# EAGLE design PIDRegler (EAGLE 7.5.0)
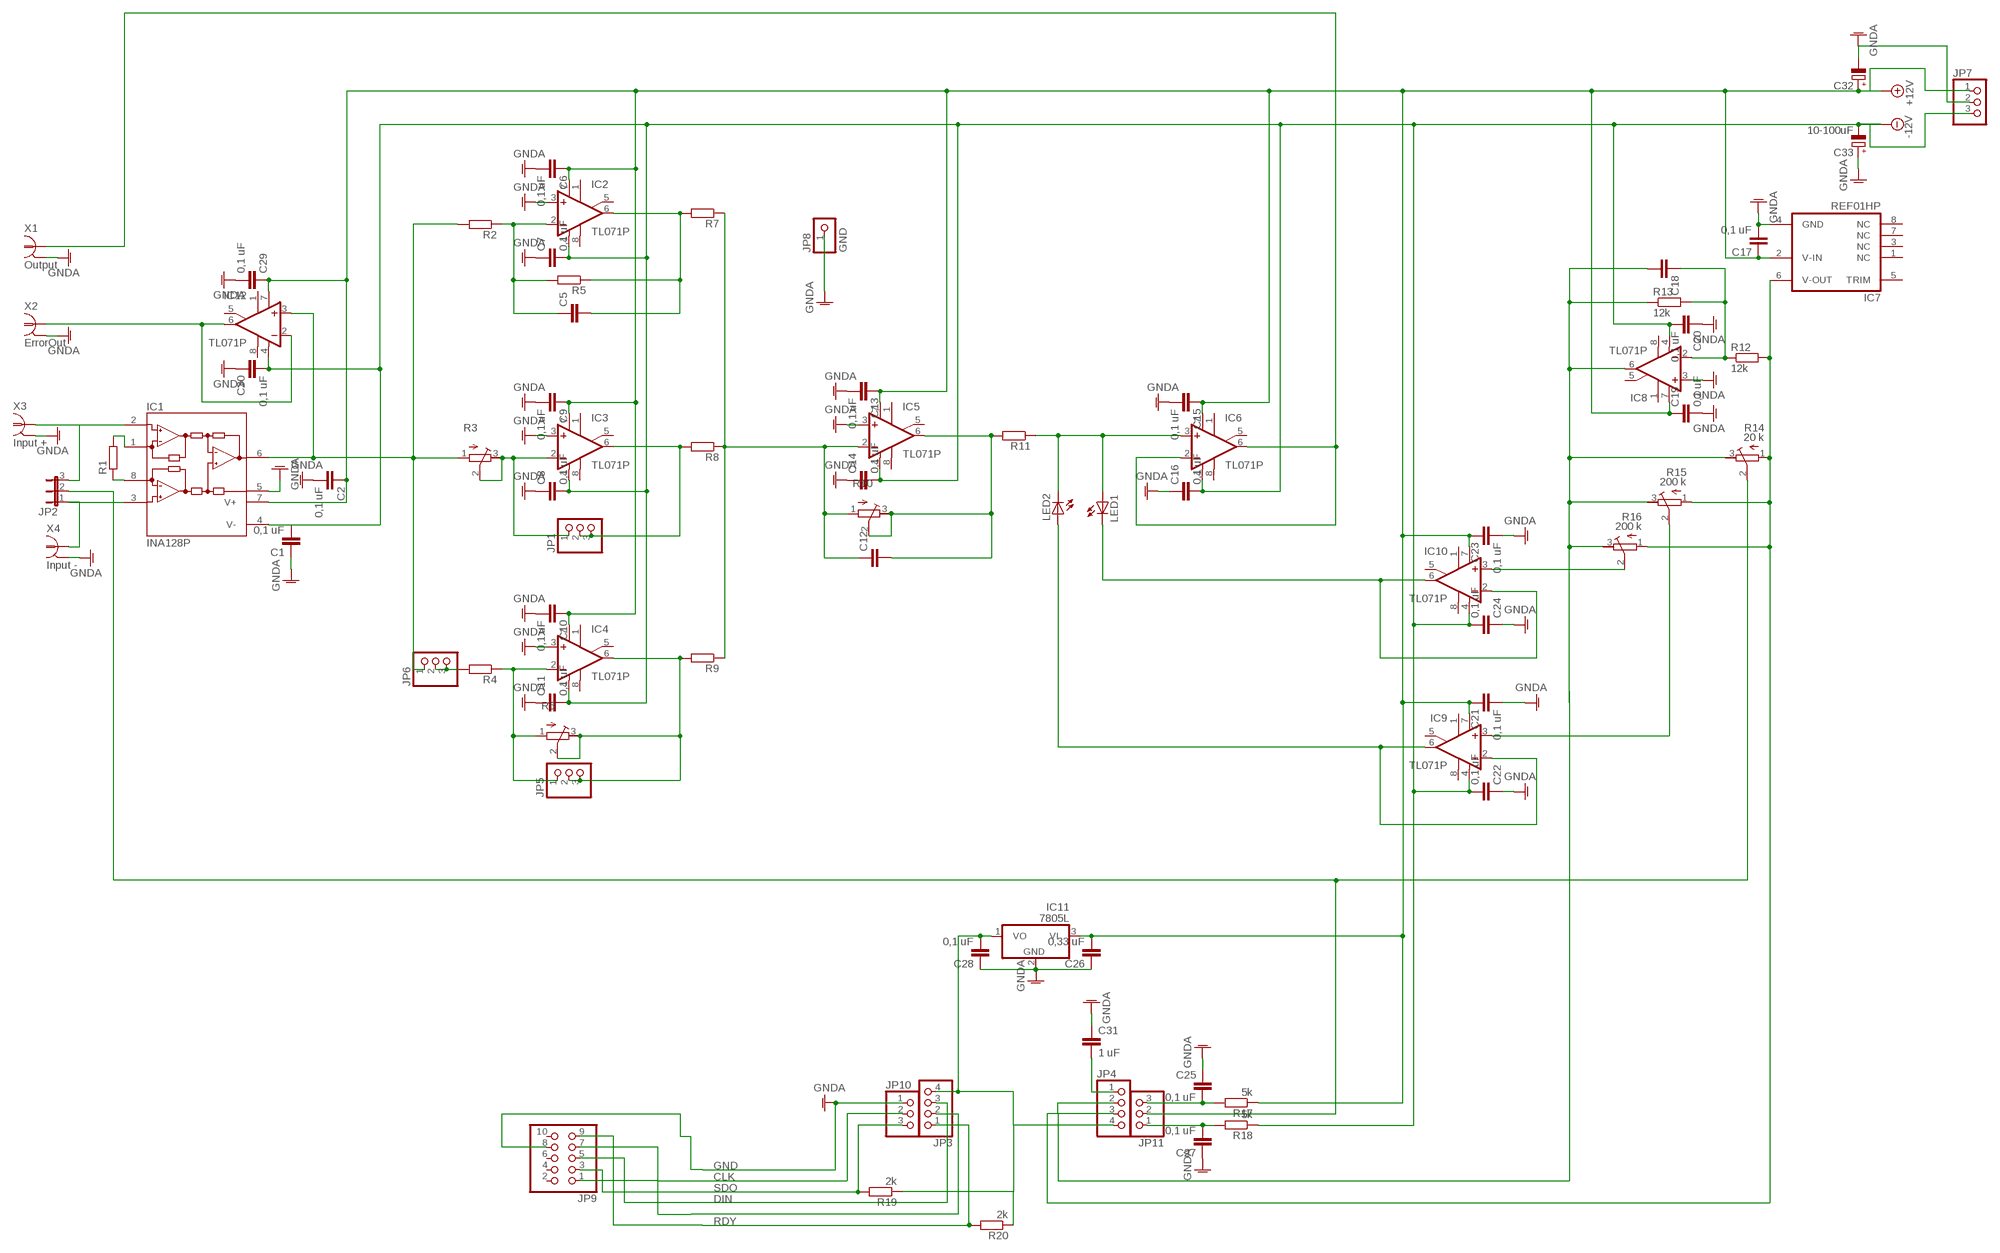
[diagram p0: schematic, sheet 1]

## Parts
C1  0,1 uF  C-EUC1206  [C1206]
C2  0,1 uF  C-EUC1206  [C1206]
C5  C-EUC1206  [C1206]
C6  0,1 uF  C-EUC1206  [C1206]
C7  0,1 uF  C-EUC1206  [C1206]
C8  0,1 uF  C-EUC1206  [C1206]
C9  0,1 uF  C-EUC1206  [C1206]
C10  0,1 uF  C-EUC1206  [C1206]
C11  0,1 uF  C-EUC1206  [C1206]
C12  C-EUC1206  [C1206]
C13  0,1 uF  C-EUC1206  [C1206]
C14  0,1 uF  C-EUC1206  [C1206]
C15  0,1 uF  C-EUC1206  [C1206]
C16  0,1 uF  C-EUC1206  [C1206]
C17  0,1 uF  C-EUC1206  [C1206]
C18  C-EUC1206  [C1206]
C19  0,1 uF  C-EUC1206  [C1206]
C20  0,1 uF  C-EUC1206  [C1206]
C21  0,1 uF  C-EUC1206  [C1206]
C22  0,1 uF  C-EUC1206  [C1206]
C23  0,1 uF  C-EUC1206  [C1206]
C24  0,1 uF  C-EUC1206  [C1206]
C25  0,1 uF  C-EUC1206  [C1206]
C26  0,33 uF  C-EUC1206  [C1206]
C27  0,1 uF  C-EUC1206  [C1206]
C28  0,1 uF  C-EUC1206  [C1206]
C29  0,1 uF  C-EUC1206  [C1206]
C30  0,1 uF  C-EUC1206  [C1206]
C31  1 uF  C-EUC1206  [C1206]
C32  CPOL-EUE2.5-6  [E2,5-6]
C33  10-100uF  CPOL-EUE2.5-6  [E2,5-6]
IC1  INA128P  [DIL08]
IC2  TL071P  [DIL08]
IC3  TL071P  [DIL08]
IC4  TL071P  [DIL08]
IC5  TL071P  [DIL08]
IC6  TL071P  [DIL08]
IC7  REF01HP  [DIL08]
IC8  TL071P  [DIL08]
IC9  TL071P  [DIL08]
IC10  TL071P  [DIL08]
IC11  7805L  [TO92]
IC12  TL071P  [DIL08]
JP1  PINHD-1X3  [1X03]
JP2  JP2E  [JP2]
JP3  PINHD-1X4  [1X04]
JP4  PINHD-1X4  [1X04]
JP5  PINHD-1X3  [1X03]
JP6  PINHD-1X3  [1X03]
JP7  PINHD-1X3  [1X03]
JP8  GND  PINHD-1X1  [1X01]
JP9  PINHD-2X5  [2X05]
JP10  PINHD-1X3  [1X03]
JP11  PINHD-1X3  [1X03]
LED1  LED5MM  [LED5MM]
LED2  LED5MM  [LED5MM]
R1  R-EU_M1206  [M1206]
R2  R-EU_M1206  [M1206]
R3  R-TRIMM64X  [RTRIM64X]
R4  R-EU_M1206  [M1206]
R5  R-EU_M1206  [M1206]
R6  R-TRIMM64X  [RTRIM64X]
R7  R-EU_M1206  [M1206]
R8  R-EU_M1206  [M1206]
R9  R-EU_M1206  [M1206]
R10  R-TRIMM64X  [RTRIM64X]
R11  R-EU_M1206  [M1206]
R12  12k  R-EU_M1206  [M1206]
R13  12k  R-EU_M1206  [M1206]
R14  20 k  R-TRIMM64X  [RTRIM64X]
R15  200 k  R-TRIMM64X  [RTRIM64X]
R16  200 k  R-TRIMM64X  [RTRIM64X]
R17  5k  R-EU_M1206  [M1206]
R18  5k  R-EU_M1206  [M1206]
R19  2k  R-EU_M1206  [M1206]
R20  2k  R-EU_M1206  [M1206]
X1  Output  1-227161-0  [AMP_227161]
X2  ErrorOut  1-227161-0  [AMP_227161]
X3  Input +  1-227161-0  [AMP_227161]
X4  Input -  1-227161-0  [AMP_227161]

## Nets
+12V: C2.1 C6.1 C9.1 C10.1 C13.1 C15.1 C17.1 C19.1 C21.1 C23.1 C26.2 C29.1 C32.+ IC1.7(V+) IC2.7(V+) IC3.7(V+) IC4.7(V+) IC5.7(V+) IC6.7(V+) IC7.2(V-IN) IC8.7(V+) IC9.7(V+) IC10.7(V+) IC11.3(VI) IC12.7(V+) JP7.1 R17.1
-12V: C1.2 C7.2 C8.2 C11.2 C14.2 C16.2 C20.2 C22.2 C24.2 C30.2 C33.- IC1.4(V-) IC2.4(V-) IC3.4(V-) IC4.4(V-) IC5.4(V-) IC6.4(V-) IC8.4(V-) IC9.4(V-) IC10.4(V-) IC12.4(V-) JP7.3 R18.1
CLK: JP9.1 JP10.2
DIN: JP3.3 JP9.5
GND: C1.1 C2.2 C6.2 C7.1 C8.1 C9.2 C10.2 C11.1 C13.2 C14.1 C15.2 C16.1 C17.2 C19.2 C20.1 C21.2 C22.1 C23.2 C24.1 C25.1 C26.1 C27.1 C28.1 C29.2 C30.1 C31.1 C32.- C33.+ IC1.5(REF) IC2.3(+IN) IC3.3(+IN) IC4.3(+IN) IC5.3(+IN) IC7.4(GND) IC8.3(+IN) IC11.2(GND) JP7.2 JP8.1 JP9.8 JP10.1 X1.2(GND) X2.2(GND) X3.2(GND) X4.2(GND) ; supply symbol labelled GNDA
N$1: IC1.3(+IN) JP2.1 X4.1
N$2: IC1.8(RG) R1.1
N$3: IC1.1(RG) R1.2
N$4: IC1.2(-IN) JP2.3 X3.1
N$5: IC1.6(OUT) IC12.3(+IN) JP6.1 R2.2 R3.1(E)
N$6: IC3.2(-IN) JP1.1 R3.2(S) R3.3(A)
N$7: JP6.2 JP6.3 R4.2
N$8: C5.1 IC2.2(-IN) R2.1 R5.2
N$9: C12.1 IC5.2(-IN) R7.1 R8.1 R9.1 R10.1(E)
N$10: C5.2 IC2.6(OUT) R5.1 R7.2
N$11: IC3.6(OUT) JP1.2 JP1.3 R8.2
N$12: IC4.6(OUT) JP5.2 JP5.3 R6.2(S) R6.3(A) R9.2
N$13: C12.2 IC5.6(OUT) R10.2(S) R10.3(A) R11.2
N$14: IC6.2(-IN) IC6.6(OUT) X1.1
N$15: IC7.6(V-OUT) JP4.3 R12.2 R14.1(E) R15.1(E) R16.1(E)
N$16: JP2.2 JP11.2 R14.2(S)
N$17: C18.1 IC8.2(-IN) R12.1 R13.2
N$19: IC4.2(-IN) JP5.1 R4.1 R6.1(E)
N$20: IC10.2(-IN) IC10.6(OUT) LED1.K(C)
N$21: IC9.3(+IN) R15.2(S)
N$22: IC9.2(-IN) IC9.6(OUT) LED2.A
N$23: IC10.3(+IN) R16.2(S)
N$24: IC6.3(+IN) LED1.A LED2.K(C) R11.1
N$25: C31.2 JP4.1
N$27: IC12.2(-IN) IC12.6(OUT) X2.1
N$28: C18.2 IC8.6(OUT) JP4.2 R13.1 R14.3(A) R15.3(A) R16.3(A)
N$30: C25.2 JP11.3 R17.2
N$31: C27.2 JP11.1 R18.2
RDY: JP3.1 JP9.9 R20.2
SDO: JP9.3 JP10.3 R19.2
SYNC: JP3.2 JP9.7
VCC: C28.2 IC11.1(VO) JP3.4 JP4.4 R19.1 R20.1
Unconnected: IC2.1(ON1) IC2.5(ON2) IC2.8(OPT) IC3.1(ON1) IC3.5(ON2) IC3.8(OPT) IC4.1(ON1) IC4.5(ON2) IC4.8(OPT) IC5.1(ON1) IC5.5(ON2) IC5.8(OPT) IC6.1(ON1) IC6.5(ON2) IC6.8(OPT) IC7.1(NC) IC7.3(NC) IC7.5(TRIM) IC7.7(NC) IC7.8(NC) IC8.1(ON1) IC8.5(ON2) IC8.8(OPT) IC9.1(ON1) IC9.5(ON2) IC9.8(OPT) IC10.1(ON1) IC10.5(ON2) IC10.8(OPT) IC12.1(ON1) IC12.5(ON2) IC12.8(OPT) JP9.2 JP9.4 JP9.6 JP9.10

## Library data of the parts
C1 C2 C5-C31 = resistor:C-EU: CAPACITOR, European symbol
C32 C33 = resistor:CPOL-EU: POLARIZED CAPACITOR, European symbol
IC1 = burr-brown:INA128: Instrumentation Amplifiers Precision, Low Power; MF: TEXAS INSTRUMENTS; MPN: INA128P; OC_FARNELL: 1212410; OC_NEWARK: 74C9783
IC2-IC6 IC8-IC10 IC12 = linear:TL071: OP AMP
IC7 = maxim:REF01HP: VOLTAGE REFERENCE; MF: ALTERA CORPORATION; MPN: REF01HP; OC_FARNELL: 9605150; OC_NEWARK: 05F8981
IC11 = linear:78*: Positive VOLTAGE REGULATOR Source: http://cache.national.com/ds/LM/LM78L05.pdf http://www.fairchildsemi.com/ds/LM/LM7805.pdf
JP1 JP5-JP7 JP10 JP11 = pinhead:PINHD-1X3: PIN HEADER
JP2 = jumper:JP2E: JUMPER
JP3 JP4 = pinhead:PINHD-1X4: PIN HEADER
JP8 = pinhead:PINHD-1X1: PIN HEADER
JP9 = pinhead:PINHD-2X5: PIN HEADER
LED1 LED2 = led:LED: LED OSRAM: - CHIPLED LG R971, LG N971, LY N971, LG Q971, LY Q971, LO R971, LY R971 LH N974, LH R974 LS Q976, LO Q976, LY Q976 LO Q996 - Hyper CHIPLED LW Q18S LB Q993, LB Q99A, LB R99A - SideLED LS A670, LO A670, LY A670, LG A670, LP A670 LB A673, LV A673, LT A673, LW A673 LH A674 LY A675 LS A676, LA A676, LO A676, LY A676, LW A676 LS A679, LY A679, LG A679 - Hyper Micro SIDELED® LS Y876, LA Y876, LO Y876, LY Y876 LT Y87S - SmartLED LW L88C, LW L88S LB L89C, LB L89S, LG L890 LS L89K, LO L89K, LY L89K LS L896, LA L896, LO L896, LY L896 - TOPLED LS T670, LO T670, LY T670, LG T670, LP T670 LSG T670, LSP T670, LSY T670, LOP T670, LYG T670 LG T671, LOG T671, LSG T671 LB T673, LV T673, LT T673, LW T673 LH T674 LS T676, LA T676, LO T676, LY T676, LB T676, LH T676, LSB T676, LW T676 LB T67C, LV T67C, LT T67C, LS T67K, LO T67K, LY T67K, LW E67C LS E67B, LA E67B, LO E67B, LY E67B, LB E67C, LV E67C, LT E67C LW T67C LS T679, LY T679, LG T679 LS T770, LO T770, LY T770, LG T770, LP T770 LB T773, LV T773, LT T773, LW T773 LH T774 LS E675, LA E675, LY E675, LS T675 LS T776, LA T776, LO T776, LY T776, LB T776 LHGB T686 LT T68C, LB T68C - Hyper Mini TOPLED® LB M676 - Mini TOPLED Santana® LG M470 LS M47K, LO M47K, LY M47K Source: http://www.osram.convergy.de LUXEON: - LUMILED® LXK2-PW12-R00, LXK2-PW12-S00, LXK2-PW14-U00, LXK2-PW14-V00 LXK2-PM12-R00, LXK2-PM12-S00, LXK2-PM14-U00 LXK2-PE12-Q00, LXK2-PE12-R00, LXK2-PE12-S00, LXK2-PE14-T00, LXK2-PE14-U00 LXK2-PB12-K00, LXK2-PB12-L00, LXK2-PB12-M00, LXK2-PB14-N00, LXK2-PB14-P00, LXK2-PB14-Q00 LXK2-PR12-L00, LXK2-PR12-M00, LXK2-PR14-Q00, LXK2-PR14-R00 LXK2-PD12-Q00, LXK2-PD12-R00, LXK2-PD12-S00 LXK2-PH12-R00, LXK2-PH12-S00 LXK2-PL12-P00, LXK2-PL12-Q00, LXK2-PL12-R00 Source: www.luxeon.com KINGBRIGHT: KA-3528ASYC Source: www.kingbright.com
R1 R2 R4 R5 R7-R9 R11-R13 R17-R20 = rcl:R-EU_: RESISTOR, European symbol
R3 R6 R10 R14-R16 = resistor:R-TRIMM: Trimm resistor
X1-X4 = con-coax:?227161*: JACK, RIGHT ANGLE, 50 OHM, PCB, BNC Source: amp_227161.pdf; MF: TYCO ELECTRONICS; MPN: 1-227161; OC_FARNELL: unknown; OC_NEWARK: 33B3200

## Board
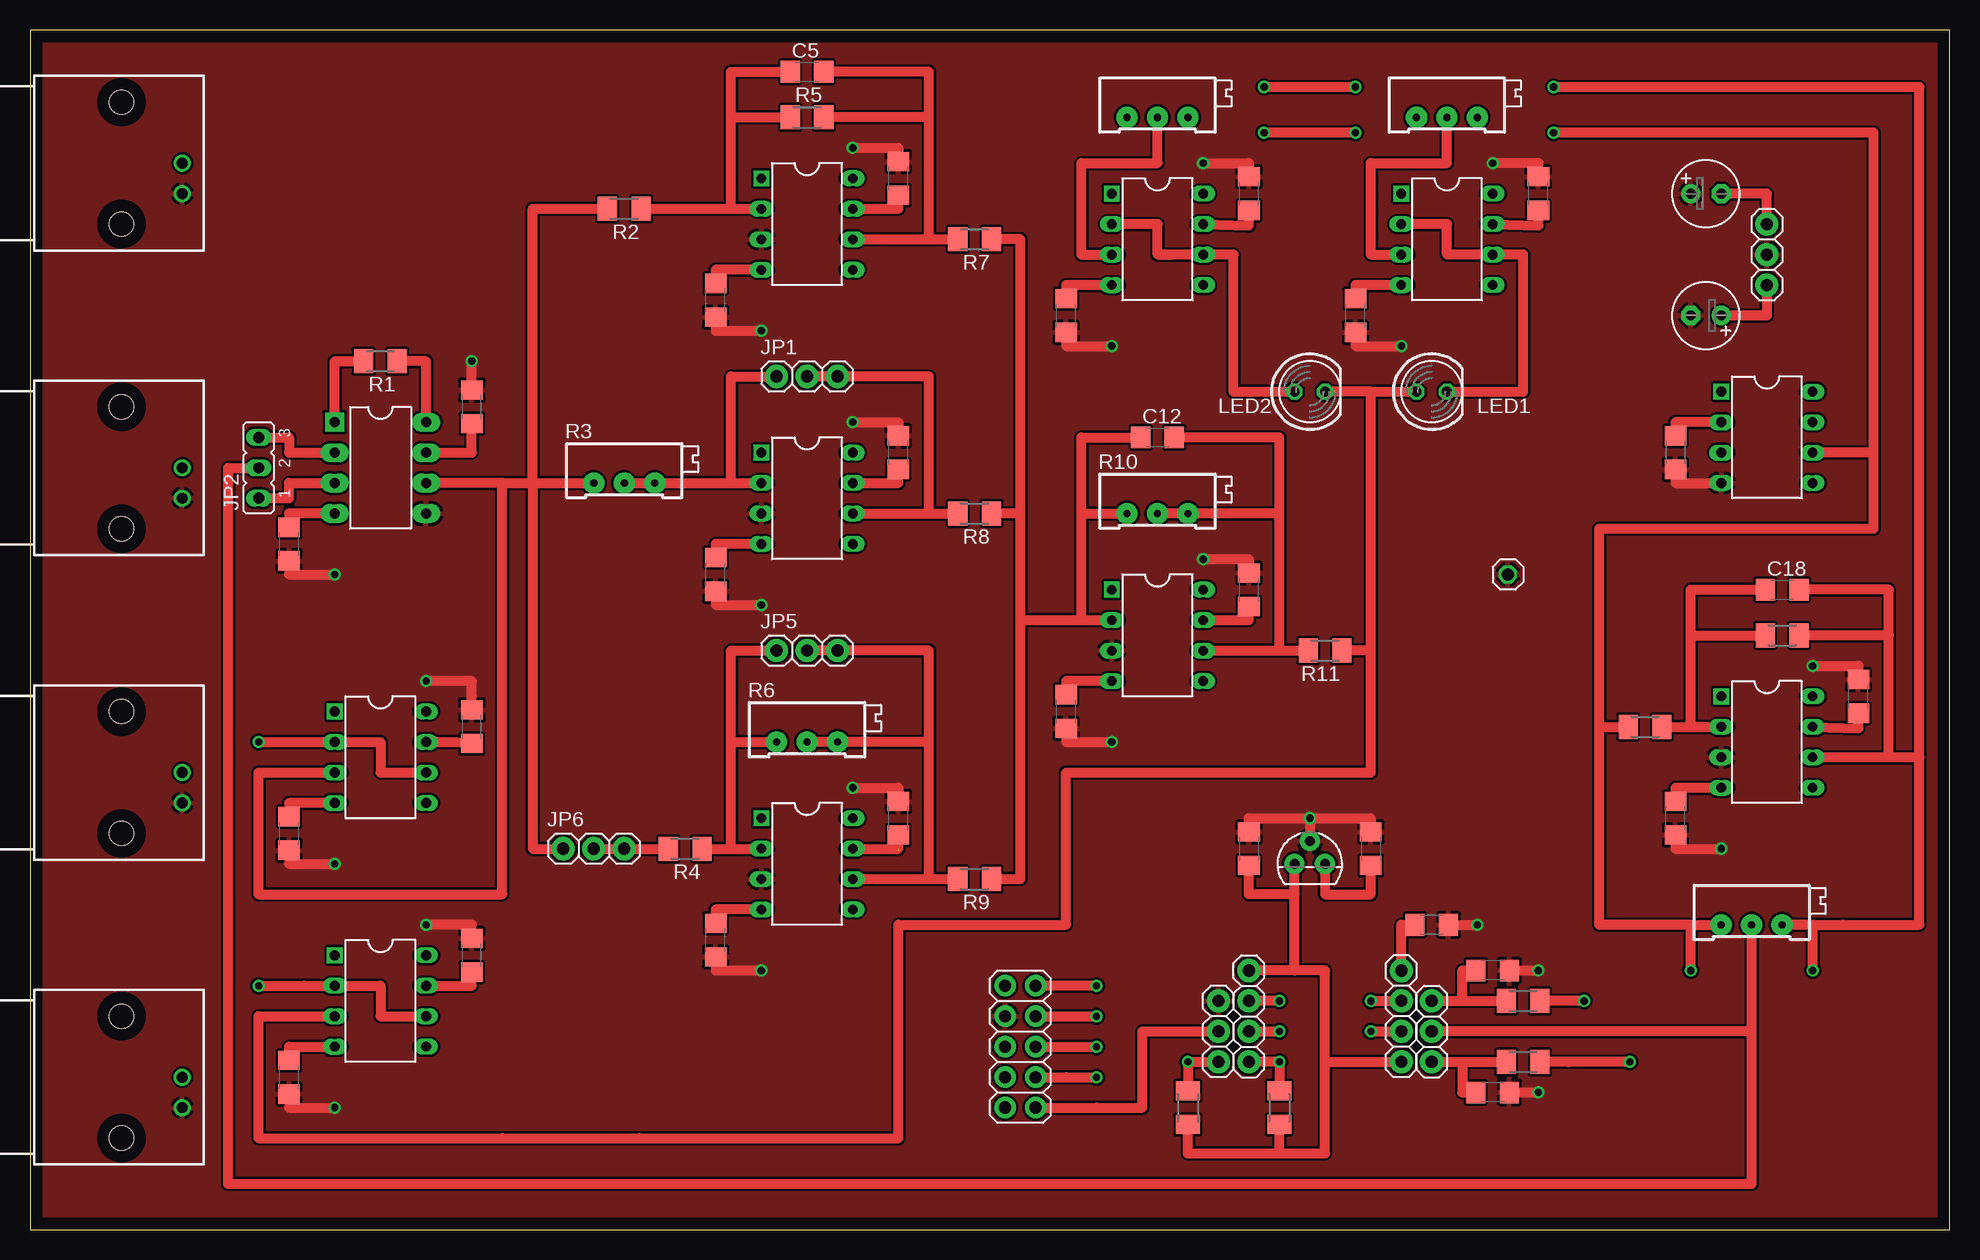
[diagram p1: board, top side]
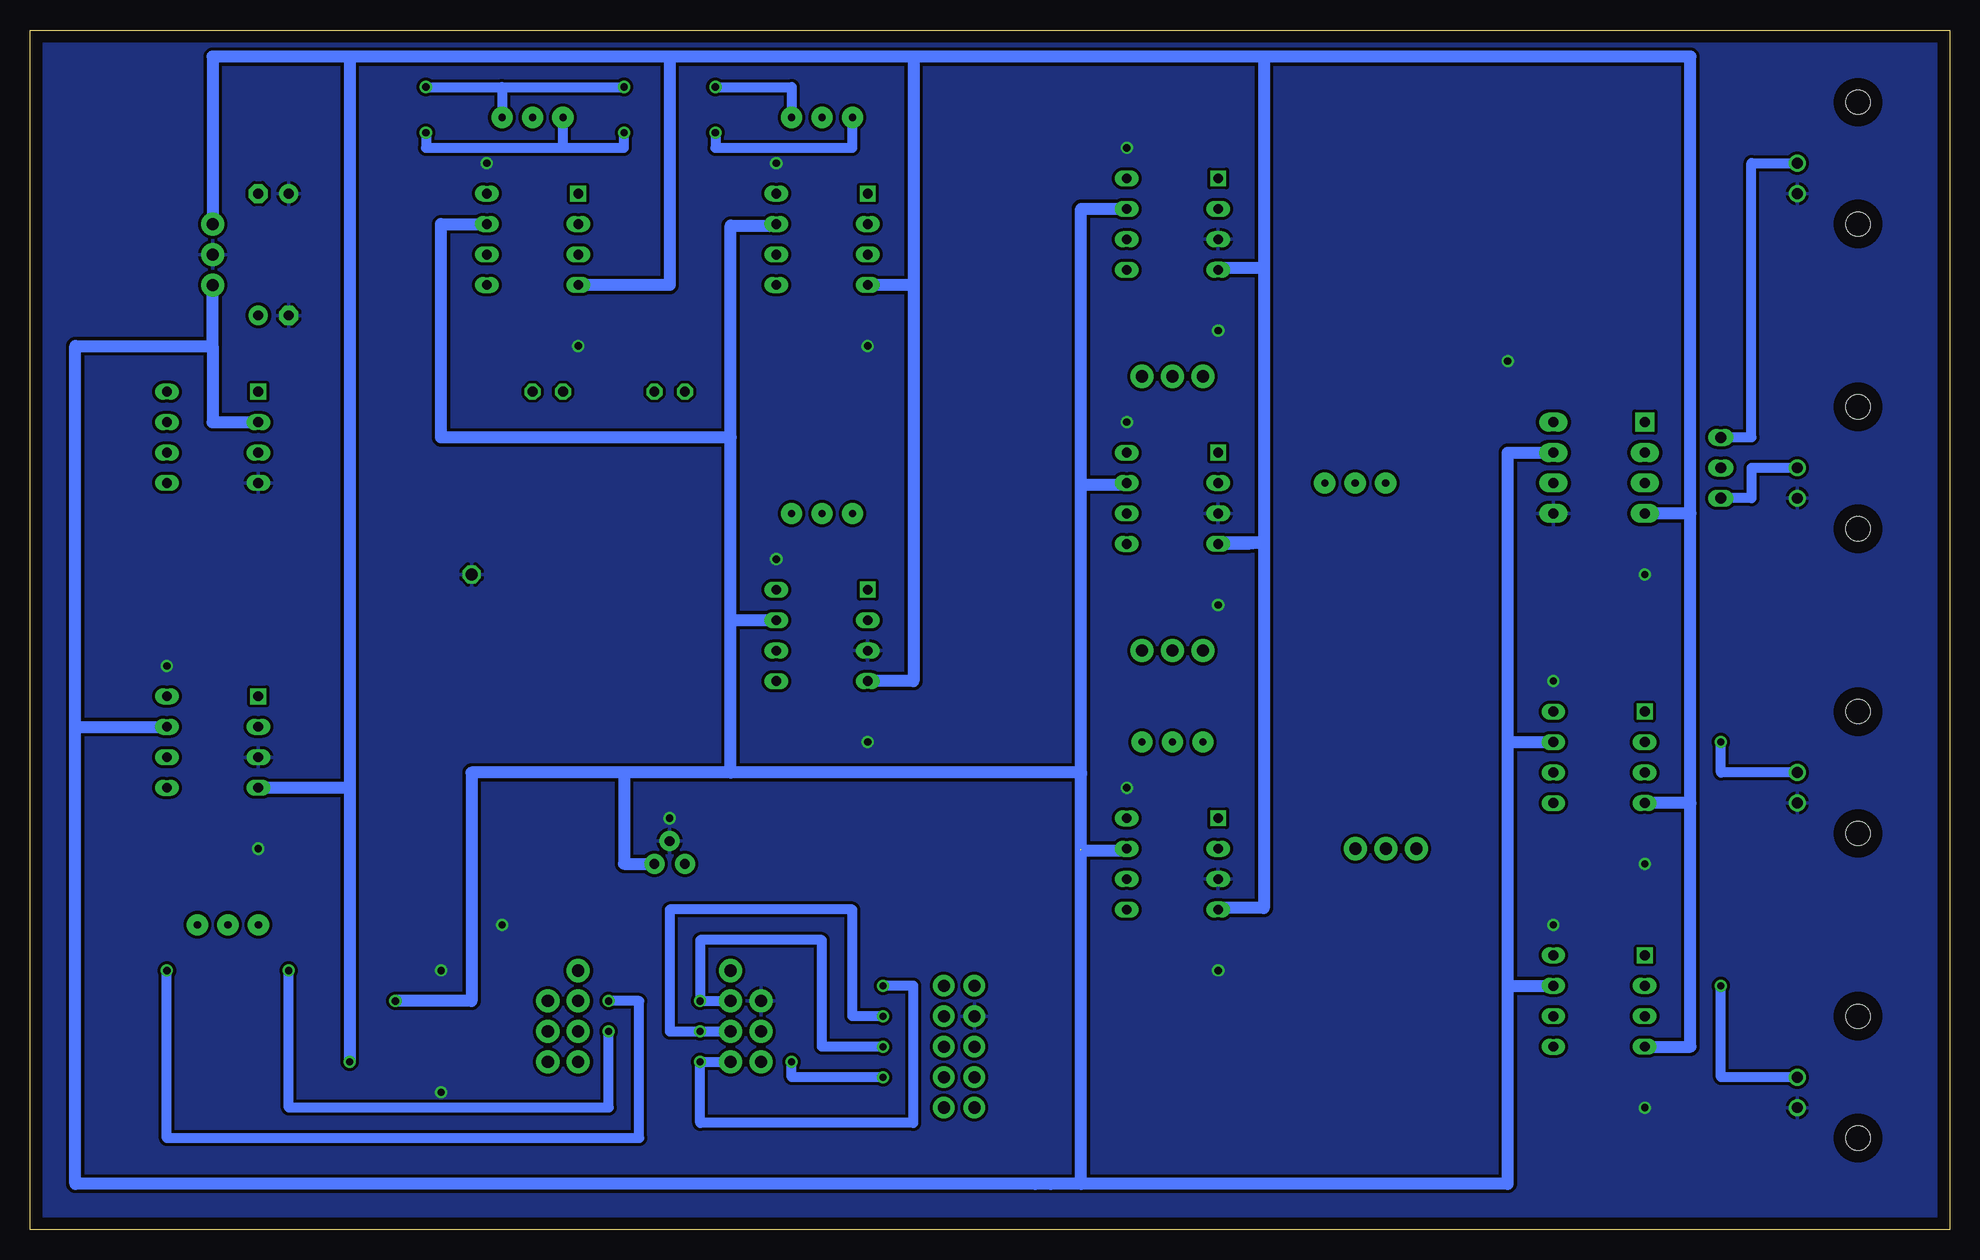
[diagram p2: board, bottom side, seen from below]

Size 160 x 100 mm. Coordinates in mm from the lower left corner, seen from the top.
Outline: 0,0 160,0
Outline: 160,0 160,100
Outline: 160,100 0,100
Outline: 0,100 0,0
Outline: 0,0 160,0
Outline: 160,0 160,100
Outline: 160,100 0,100
Outline: 0,100 0,0
Copper layers (1*16): Top 0.035mm / dielectric 1.5mm / Bottom 0.035mm
Design rules "default *": minimum track width 10mil, minimum drill 24mil, track to track 8mil, track to pad 8mil, pad to pad 8mil, via to via 8mil, smd to smd 8mil, copper to edge 40mil, drill to drill 8mil, minimum pad ring 10mil, minimum via ring 8mil, stop-mask expansion 4mil, vias tented up to drill 0mil, thermal gap 10mil

### Footprints (pad centres in the part's own frame; a part is rotated, then mirrored left to right if it is on the bottom)
C1206 = smd 1.6 x 1.8: 1 -1.4,0; 2 1.4,0
E2,5-6 = drill 0.813 pad 1.6: + -1.27,0 | drill 0.813 pad 1.6 octagon: - 1.27,0
DIL08 = drill 0.813 pad 1.6 square: 1 -3.81,-3.81 | drill 0.813 pad 1.6 long: 2 -1.27,-3.81; 3 1.27,-3.81; 4 3.81,-3.81; 5 3.81,3.81; 6 1.27,3.81; 7 -1.27,3.81; 8 -3.81,3.81
DIL08' = drill 0.813 pad 1.27 square: 1 -3.81,-3.81 | drill 0.813 pad 1.27 long: 2 -1.27,-3.81; 3 1.27,-3.81; 4 3.81,-3.81; 5 3.81,3.81; 6 1.27,3.81; 7 -1.27,3.81; 8 -3.81,3.81
DIL08'' = drill 0.813 square: 1 -3.81,-3.81 | drill 0.813 long: 2 -1.27,-3.81; 3 1.27,-3.81; 4 3.81,-3.81; 5 3.81,3.81; 6 1.27,3.81; 7 -1.27,3.81; 8 -3.81,3.81
TO92 = drill 0.813 pad 1.676: 1 -1.27,0; 2 0,1.905; 3 1.27,0
1X03 = drill 1.016 pad 1.93: 1 -2.54,0; 2 0,0; 3 2.54,0
JP2 = drill 0.914 long: 1 -2.54,0; 2 0,0; 3 2.54,0
1X04 = drill 1.016 pad 1.93: 1 -3.81,0; 2 -1.27,0; 3 1.27,0; 4 3.81,0
1X01 = drill 1.016 octagon: 1 0,0
2X05 = drill 1.016 pad 1.778: 1 -5.08,-1.27; 2 -5.08,1.27; 3 -2.54,-1.27; 4 -2.54,1.27; 5 0,-1.27; 6 0,1.27; 7 2.54,-1.27; 8 2.54,1.27; 9 5.08,-1.27; 10 5.08,1.27
LED5MM = drill 0.813 octagon: A -1.27,0; K 1.27,0
M1206 = smd 1.6 x 2: 1 -1.4,0; 2 1.4,0
RTRIM64X = drill 0.61 pad 1.778: 1 1.27,-2.54; 2 1.27,0; 3 1.27,2.54
AMP_227161 = drill 0.9 pad 1.27: 1 0,-5.08; 2 -2.54,-5.08 | hole 2: -5.08,0; 5.08,0

### Placement (x,y rotation side)
C1  21.59,57.15 90 top
C2  36.83,68.58 90 top
C5  64.77,96.52 0 top
C6  72.39,87.63 90 top
C7  57.15,77.47 90 top
C8  57.15,54.61 90 top
C9  72.39,64.77 90 top
C10  72.39,34.29 90 top
C11  57.15,24.13 90 top
C12  93.98,66.04 0 top
C13  101.6,53.34 90 top
C14  86.36,43.18 90 top
C15  36.83,22.86 90 top
C16  21.59,12.7 90 top
C17  137.16,64.77 270 top
C18  146.05,53.34 0 top
C19  152.4,44.45 90 top
C20  137.16,34.29 90 top
C21  125.73,86.36 90 top
C22  110.49,76.2 90 top
C23  101.6,86.36 90 top
C24  86.36,76.2 90 top
C25  121.92,21.59 180 top
C26  111.76,31.75 270 top
C27  121.92,11.43 180 top
C28  101.6,31.75 270 top
C29  36.83,41.91 90 top
C30  21.59,33.02 90 top
C31  116.84,25.4 180 top
C32  139.7,76.2 180 top
C33  139.7,86.36 0 top
IC1  29.21,63.5 270 top
IC2  TL071P  [DIL08']  64.77,83.82 270 top
IC3  TL071P  [DIL08']  64.77,60.96 270 top
IC4  TL071P  [DIL08']  64.77,30.48 270 top
IC5  TL071P  [DIL08']  93.98,49.53 270 top
IC6  TL071P  [DIL08']  29.21,19.05 270 top
IC7  REF01HP  [DIL08'']  144.78,66.04 270 top
IC8  TL071P  [DIL08']  144.78,40.64 270 top
IC9  TL071P  [DIL08']  93.98,82.55 270 top
IC10  TL071P  [DIL08']  118.11,82.55 270 top
IC11  106.68,30.48 0 top
IC12  TL071P  [DIL08']  29.21,39.37 270 top
JP1  64.77,71.12 0 top
JP2  19.05,63.5 90 top
JP3  101.6,17.78 90 top
JP4  114.3,17.78 270 top
JP5  64.77,48.26 0 top
JP6  46.99,31.75 0 top
JP7  144.78,81.28 90 top
JP8  123.19,54.61 0 top
JP9  82.55,15.24 90 top
JP10  99.06,16.51 270 top
JP11  116.84,16.51 90 top
LED1  116.84,69.85 0 top
LED2  106.68,69.85 0 top
R1  29.21,72.39 180 top
R2  49.53,85.09 180 top
R3  49.53,63.5 270 top
R4  54.61,31.75 180 top
R5  64.77,92.71 180 top
R6  64.77,41.91 270 top
R7  78.74,82.55 180 top
R8  78.74,59.69 180 top
R9  78.74,29.21 180 top
R10  93.98,60.96 270 top
R11  107.95,48.26 180 top
R12  134.62,41.91 180 top
R13  146.05,49.53 180 top
R14  143.51,26.67 270 top
R15  93.98,93.98 270 top
R16  118.11,93.98 270 top
R17  124.46,19.05 180 top
R18  124.46,13.97 180 top
R19  96.52,10.16 90 top
R20  104.14,10.16 90 top
X1  7.62,12.7 90 top
X2  7.62,38.1 90 top
X3  7.62,88.9 90 top
X4  7.62,63.5 90 top

### Tracks (layer width: path | path; a pad name or v marks a point on that pad's centre or on a via)
+12V  (via drill 0.6)  (1 unrouted)
  Top 0.813: C29.1 35.56,40.64 IC12.7 | C2.1 36.83,64.77 IC1.7 | C15.1 36.83,20.32 IC6.7 | C6.1 72.39,85.09 IC2.7 | C9.1 72.39,62.23 IC3.7 | 72.39,31.75 C10.1 | 72.39,31.75 IC4.7 72.39,31.75 | R17.1 125.73,19.05 v129.54,19.05 | C23.1 101.6,83.69 IC9.7 | 125.73,83.69 IC10.7 125.73,83.69 | C19.1 152.4,41.78 IC8.7 | C13.1 101.6,50.8 IC5.7 | 125.73,83.69 C21.1 | C17.1 137.16,67.31 IC7.2 | JP7.1 144.78,76.2 C32.+ | C26.2 111.76,27.94 107.95,27.94 IC11.3
  Bottom 1.016: 36.83,20.32 IC6.7 | 36.83,20.32 36.83,40.64 | 36.83,40.64 IC12.7 | 36.83,40.64 36.83,64.77 IC1.7 | 72.39,3.81 72.39,31.62 | 72.39,31.62 72.39,37.97 | 72.39,3.81 74.93,3.81 | 72.39,3.81 36.83,3.81 36.83,20.19 36.83,20.32 | 72.39,3.81 74.93,3.81 | 72.39,37.97 72.39,38.1 | 72.39,38.1 72.39,62.1 | 72.39,62.1 72.39,85.09 IC2.7 | IC9.7 97.79,83.69 101.6,83.69 101.6,66.04 | 101.6,50.8 101.6,66.04 | 101.6,50.8 IC5.7 101.6,50.8 | v129.54,19.05 123.19,19.05 123.19,38.1 110.49,38.1 | 156.21,41.91 IC8.7 156.21,41.91 | 156.21,41.91 156.21,3.81 76.2,3.81 74.93,3.81 | 156.21,41.91 156.21,73.66 144.78,73.66 | IC10.7 125.73,83.82 125.73,66.04 101.6,66.04 | 144.78,73.66 JP7.1 | IC7.2 144.78,67.31 144.78,73.66 | 72.39,37.97 72.39,38.1 | 72.39,38.1 101.6,38.1 | 101.6,38.1 110.49,38.1 | 72.39,37.97 72.39,38.1 | IC11.3 110.49,30.48 110.49,38.1 | 101.6,38.1 101.6,50.8 | 72.39,31.62 68.58,31.62 | 72.39,62.1 68.58,62.1 IC3.7
-12V  (via drill 0.6)
  Top 0.813: C16.2 21.59,15.24 IC6.4 | C14.2 86.36,45.72 IC5.4 | C24.2 86.36,78.74 IC9.4 | C7.2 57.15,80.01 IC2.4 | C8.2 57.15,57.15 IC3.4 | C11.2 57.15,26.67 IC4.4 | C30.2 21.59,35.56 IC12.4 | C1.2 21.59,59.69 IC1.4 | C20.2 137.16,36.83 IC8.4 | C22.2 110.49,78.74 IC10.4 | R18.1 128.27,13.97 v133.35,13.97 | JP7.3 144.78,86.36 C33.-
  Bottom 1.016: IC6.4 21.59,15.24 21.59,35.56 | 21.59,35.56 IC12.4 | 21.59,35.56 21.59,59.69 | 21.59,59.69 24.13,59.69 | 24.13,59.69 IC1.4 | IC4.4 60.96,26.8 57.15,26.8 57.15,57.28 | 57.15,57.28 58.42,57.15 IC3.4 60.96,57.28 57.15,57.28 | 57.15,97.79 57.15,80.14 | 57.15,80.14 57.15,57.28 | 57.15,97.79 21.59,97.79 21.59,59.69 | 21.59,59.69 24.13,59.69 | IC2.4 60.96,80.14 57.15,80.14 | 86.36,78.74 IC9.4 | 86.36,97.79 86.36,78.74 | 57.15,97.79 86.36,97.79 | 86.36,78.74 IC9.4 | 86.36,45.72 IC5.4 86.36,45.72 | 86.36,78.74 IC9.4 | 86.36,78.74 86.36,45.72 | 106.68,78.74 IC10.4 106.68,78.74 | 106.68,97.79 106.68,78.74 | 86.36,97.79 106.68,97.79 | 106.68,97.79 133.35,97.79 | 133.35,97.79 137.16,97.79 | 137.16,97.79 144.78,97.79 JP7.3 | 135.89,36.83 IC8.4 135.89,36.83 | 137.16,97.79 138.43,97.79 | 133.35,36.83 135.89,36.83 | 133.35,36.83 133.35,27.94 v133.35,13.97 | 133.35,36.83 135.89,36.83 | 133.35,97.79 133.35,36.83
CLK
  Top 0.813: JP9.1 88.9,10.16 92.71,10.16 92.71,16.51 JP10.2
DIN  (via drill 0.6)
  Top 0.813: JP9.5 v88.9,15.24 | v104.14,19.05 JP3.3
  Bottom 0.813: v88.9,15.24 93.98,15.24 93.98,24.13 104.14,24.13 v104.14,19.05 JP3.3
GND  (via drill 0.6)
  Top 0.813: IC7.4 137.16,62.23 C17.2 | C11.1 57.15,21.59 v60.96,21.59 | 101.6,54.61 C13.2 101.6,55.88 v97.79,55.88 | C29.2 36.83,44.45 | 36.83,44.45 36.83,45.72 | 36.83,44.45 36.83,45.72 | 36.83,44.45 36.83,45.72 | 36.83,45.72 v33.02,45.72 | C30.1 21.59,31.75 21.59,30.48 v25.4,30.48 | C7.1 57.15,74.93 v60.96,74.93 | C16.1 21.59,10.16 v25.4,10.16 | C15.2 36.83,25.4 34.29,25.4 v33.02,25.4 | C10.2 72.39,36.83 v68.58,36.83 | C9.2 72.39,67.31 v68.58,67.31 | C6.2 72.39,90.17 v68.58,90.17 | C8.1 57.15,52.07 v60.96,52.07 | C14.1 86.36,40.64 v90.17,40.64 | C24.1 86.36,73.66 v90.17,73.66 | C22.1 110.49,73.66 v114.3,73.66 | C23.2 101.6,88.9 v97.79,88.9 | C21.2 125.73,88.9 v121.92,88.9 | C20.1 137.16,31.75 v140.97,31.75 | C19.2 152.4,46.99 v148.59,46.99 | C27.1 v125.73,11.43 | C25.1 v125.73,21.59 | C31.1 v120.65,25.4 | C26.1 111.76,34.29 v106.68,34.29 | v106.68,34.29 IC11.2 | v106.68,34.29 101.6,34.29 C28.1 | C1.1 21.59,54.61 v25.4,54.61 | 36.83,69.85 C2.2 v36.83,72.39
  pour Bottom (isolate 0.254): 0,100.33 0,0 160.02,0 160.02,100.33
  pour Top: 0,100.33 160.02,100.33 160.02,0 0,0
N$1
  Top 0.813: JP2.1 21.59,60.96 21.59,62.23 IC1.3
  Bottom 0.813: JP2.1 16.51,60.96 16.51,63.5 X4.1
N$2
  Top 0.813: R1.1 33.02,72.39 IC1.8
N$3
  Top 0.813: IC1.1 25.4,72.39 R1.2
N$4
  Top 0.813: IC1.2 21.59,64.77 21.59,66.04 JP2.3
  Bottom 0.813: JP2.3 16.51,66.04 16.51,88.9 X3.1
N$5
  Top 0.813: 41.91,62.23 41.91,31.75 JP6.1 | 41.91,62.23 41.91,85.09 R2.2 | 41.91,62.23 R3.1 | 39.37,62.23 41.91,62.23 | 39.37,62.23 IC1.6 | IC12.3 19.05,38.1 19.05,27.94 39.37,27.94 39.37,62.23
N$6
  Top 0.813: R3.2 R3.3 58.42,62.23 | 58.42,62.23 IC3.2 | JP1.1 58.42,71.12 58.42,62.23
N$7
  Top 0.813: JP6.2 JP6.3 R4.2
N$8
  Top 0.813: R2.1 58.42,85.09 | 58.42,85.09 IC2.2 | 58.42,92.71 R5.2 | 58.42,85.09 58.42,92.71 | C5.1 58.42,96.52 58.42,92.71
N$9
  Top 0.813: R7.1 82.55,82.55 82.55,59.69 | 82.55,50.8 82.55,29.21 R9.1 | 82.55,50.8 82.55,59.69 | 82.55,59.69 R8.1 | C12.1 87.63,66.04 87.63,59.69 | 87.63,59.69 R10.1 87.63,59.69 | 87.63,50.8 87.63,59.69 | 87.63,50.8 IC5.2 | 87.63,50.8 87.63,59.69 | 82.55,50.8 87.63,50.8
N$10
  Top 0.813: IC2.6 74.93,82.55 | 74.93,82.55 R7.2 | 74.93,92.71 R5.1 | 74.93,82.55 74.93,92.71 | C5.2 74.93,96.52 74.93,92.71
N$11
  Top 0.813: IC3.6 74.93,59.69 | 74.93,59.69 R8.2 | JP1.2 JP1.3 74.93,71.12 74.93,59.69
N$12
  Top 0.813: IC4.6 74.93,29.21 | 74.93,29.21 R9.2 | R6.2 R6.3 74.93,40.64 | 74.93,29.21 74.93,40.64 | 74.93,40.64 74.93,48.26 JP5.3 JP5.2
N$13
  Top 0.813: R10.3 R10.2 | 104.14,59.69 R10.3 | 104.14,59.69 104.14,66.04 C12.2 | 104.14,59.69 R10.3 | 104.14,48.26 104.14,59.69 | IC5.6 104.14,48.26 | 104.14,48.26 R11.2
N$14  (via drill 0.6)
  Top 0.813: v19.05,20.32 22.86,20.32 IC6.2 29.21,20.32 29.21,17.78 IC6.6
  Bottom 0.813: v19.05,20.32 19.05,12.7 X1.1
N$15  (via drill 0.6)
  Top 0.813: 153.67,64.77 IC7.6 | 153.67,58.42 153.67,64.77 | 153.67,58.42 134.62,58.42 130.81,58.42 | 138.43,25.4 130.81,25.4 | 138.43,25.4 R14.1 | 130.81,25.4 130.81,41.91 | 130.81,41.91 130.81,58.42 | 130.81,58.42 153.67,58.42 | 153.67,58.42 153.67,64.77 | 153.67,64.77 153.67,91.44 v127,91.44 | v110.49,91.44 v102.87,91.44 | 138.43,25.4 130.81,25.4 | v138.43,21.59 138.43,25.4 | 130.81,41.91 R12.2 | v111.76,16.51 JP4.3
  Bottom 0.813: 115.57,90.17 127,90.17 v127,91.44 | 115.57,90.17 R16.1 | R15.1 91.44,90.17 102.87,90.17 v102.87,91.44 | v111.76,16.51 111.76,10.16 138.43,10.16 v138.43,21.59 | 115.57,90.17 110.49,90.17 v110.49,91.44
N$16
  Top 0.813: R14.2 143.51,17.78 143.51,16.51 | 143.51,16.51 143.51,3.81 53.34,3.81 | 16.51,3.81 53.34,3.81 | 16.51,3.81 53.34,3.81 | 16.51,3.81 53.34,3.81 | 16.51,3.81 16.51,24.13 16.51,63.5 JP2.2 | 143.51,16.51 JP11.2
N$17
  Top 0.813: 138.43,49.53 R13.2 | 138.43,49.53 138.43,41.91 139.7,41.91 | C18.1 138.43,53.34 138.43,49.53 | 139.7,41.91 IC8.2 | R12.1 139.7,41.91
N$19
  Top 0.813: R4.1 58.42,31.75 | 58.42,31.75 IC4.2 | 58.42,40.64 R6.1 | 58.42,31.75 58.42,40.64 | 58.42,40.64 58.42,48.26 JP5.1
N$20
  Top 0.813: IC10.2 118.11,83.82 118.11,81.28 IC10.6 124.46,81.28 124.46,69.85 LED1.K
N$21
  Top 0.813: R15.2 93.98,88.9 87.63,88.9 87.63,81.28 IC9.3
N$22
  Top 0.813: 93.98,81.28 IC9.6 100.33,81.28 100.33,69.85 LED2.A | 93.98,81.28 95.25,81.28 93.98,81.28 | 93.98,81.28 93.98,83.82 IC9.2
N$23
  Top 0.813: R16.2 118.11,88.9 111.76,88.9 111.76,81.28 IC10.3
N$24
  Top 0.813: 111.76,48.26 R11.1 | IC6.3 19.05,17.78 19.05,7.62 39.37,7.62 50.8,7.62 72.39,7.62 72.39,25.4 86.36,25.4 86.36,38.1 111.76,38.1 111.76,43.18 111.76,48.26 | 111.76,48.26 R11.1 | 111.76,48.26 111.76,69.85 | 111.76,48.26 R11.1 | 111.76,69.85 LED2.K | 111.76,69.85 LED1.A
N$25
  Top 0.813: C31.2 114.3,25.4 114.3,24.13 JP4.1
N$27  (via drill 0.6)
  Top 0.813: IC12.6 29.21,38.1 29.21,40.64 IC12.2 v19.05,40.64
  Bottom 0.813: v19.05,40.64 19.05,38.1 X2.1
N$28  (via drill 0.6)
  Top 0.813: 154.94,53.34 C18.2 | 154.94,49.53 154.94,53.34 | 154.94,39.37 154.94,49.53 | 154.94,49.53 154.94,53.34 | 154.94,49.53 154.94,53.34 | 154.94,39.37 IC8.6 | 154.94,49.53 R13.1 154.94,49.53 | 157.48,39.37 157.48,25.4 151.13,25.4 | 157.48,39.37 154.94,39.37 | 148.59,25.4 R14.3 | 148.59,25.4 151.13,25.4 | 154.94,39.37 154.94,49.53 | 154.94,49.53 154.94,53.34 | 154.94,49.53 154.94,53.34 | 157.48,39.37 154.94,39.37 | 157.48,39.37 157.48,95.25 v127,95.25 | v110.49,95.25 v102.87,95.25 | 148.59,25.4 151.13,25.4 | v148.59,21.59 148.59,25.4 | v111.76,19.05 JP4.2
  Bottom 0.406: 120.65,95.25 R16.3
  Bottom 0.813: v127,95.25 120.65,95.25 | 120.65,95.25 R16.3 | 120.65,95.25 v110.49,95.25 | v102.87,95.25 96.52,95.25 R15.3 | v111.76,19.05 109.22,19.05 109.22,7.62 148.59,7.62 v148.59,21.59
N$30
  Top 0.813: 119.38,19.05 119.38,21.59 C25.2 | 119.38,19.05 R17.2 | JP11.3 119.38,19.05
N$31
  Top 0.813: JP11.1 119.38,13.97 | 119.38,13.97 R18.2 | C27.2 119.38,11.43 119.38,13.97
RDY  (via drill 0.6)
  Top 0.813: R20.2 104.14,11.43 v104.14,13.97 JP3.1 | v88.9,20.32 JP9.9
  Bottom 0.813: JP3.1 v104.14,13.97 104.14,8.89 86.36,8.89 86.36,20.32 v88.9,20.32
SDO  (via drill 0.6)
  Top 0.813: v96.52,13.97 96.52,11.43 | 96.52,11.43 R19.2 | v96.52,13.97 96.52,11.43 | v96.52,13.97 JP10.3 | JP9.3 86.36,12.7 | 86.36,12.7 v88.9,12.7 86.36,12.7
  Bottom 0.813: v88.9,12.7 96.52,12.7 v96.52,13.97
SYNC  (via drill 0.6)
  Top 0.813: JP9.7 v88.9,17.78 | JP3.2 v104.14,16.51
  Bottom 0.813: JP3.2 102.87,16.51 106.68,16.51 106.68,22.86 106.68,24.13 106.68,26.67 91.44,26.67 91.44,24.13 91.44,17.78 v88.9,17.78
VCC
  Top 0.813: 105.41,21.59 102.87,21.59 | 105.41,21.59 105.41,27.94 | 105.41,27.94 IC11.1 | C28.2 101.6,27.94 105.41,27.94 | 107.95,13.97 107.95,6.35 105.41,6.35 104.14,6.35 | 107.95,13.97 107.95,21.59 105.41,21.59 | 105.41,21.59 102.87,21.59 | R19.1 96.52,6.35 104.14,6.35 | 104.14,6.35 R20.1 | 107.95,13.97 JP4.4 | 102.87,21.59 JP3.4

### Text on the board
tValues: Lower Limit | Upper Limit | designed by | -10V | MojoElectronics | Heidelberg 2011 | +10V | P | -12 V | GND | +12 V | I | Sum | D | +10V | -10V | RDY | SYNC | DIN | SDO | OutputBuffer | CLK | AD5293